# EAGLE design tx_uts_wafer1 (EAGLE 8.3.2)
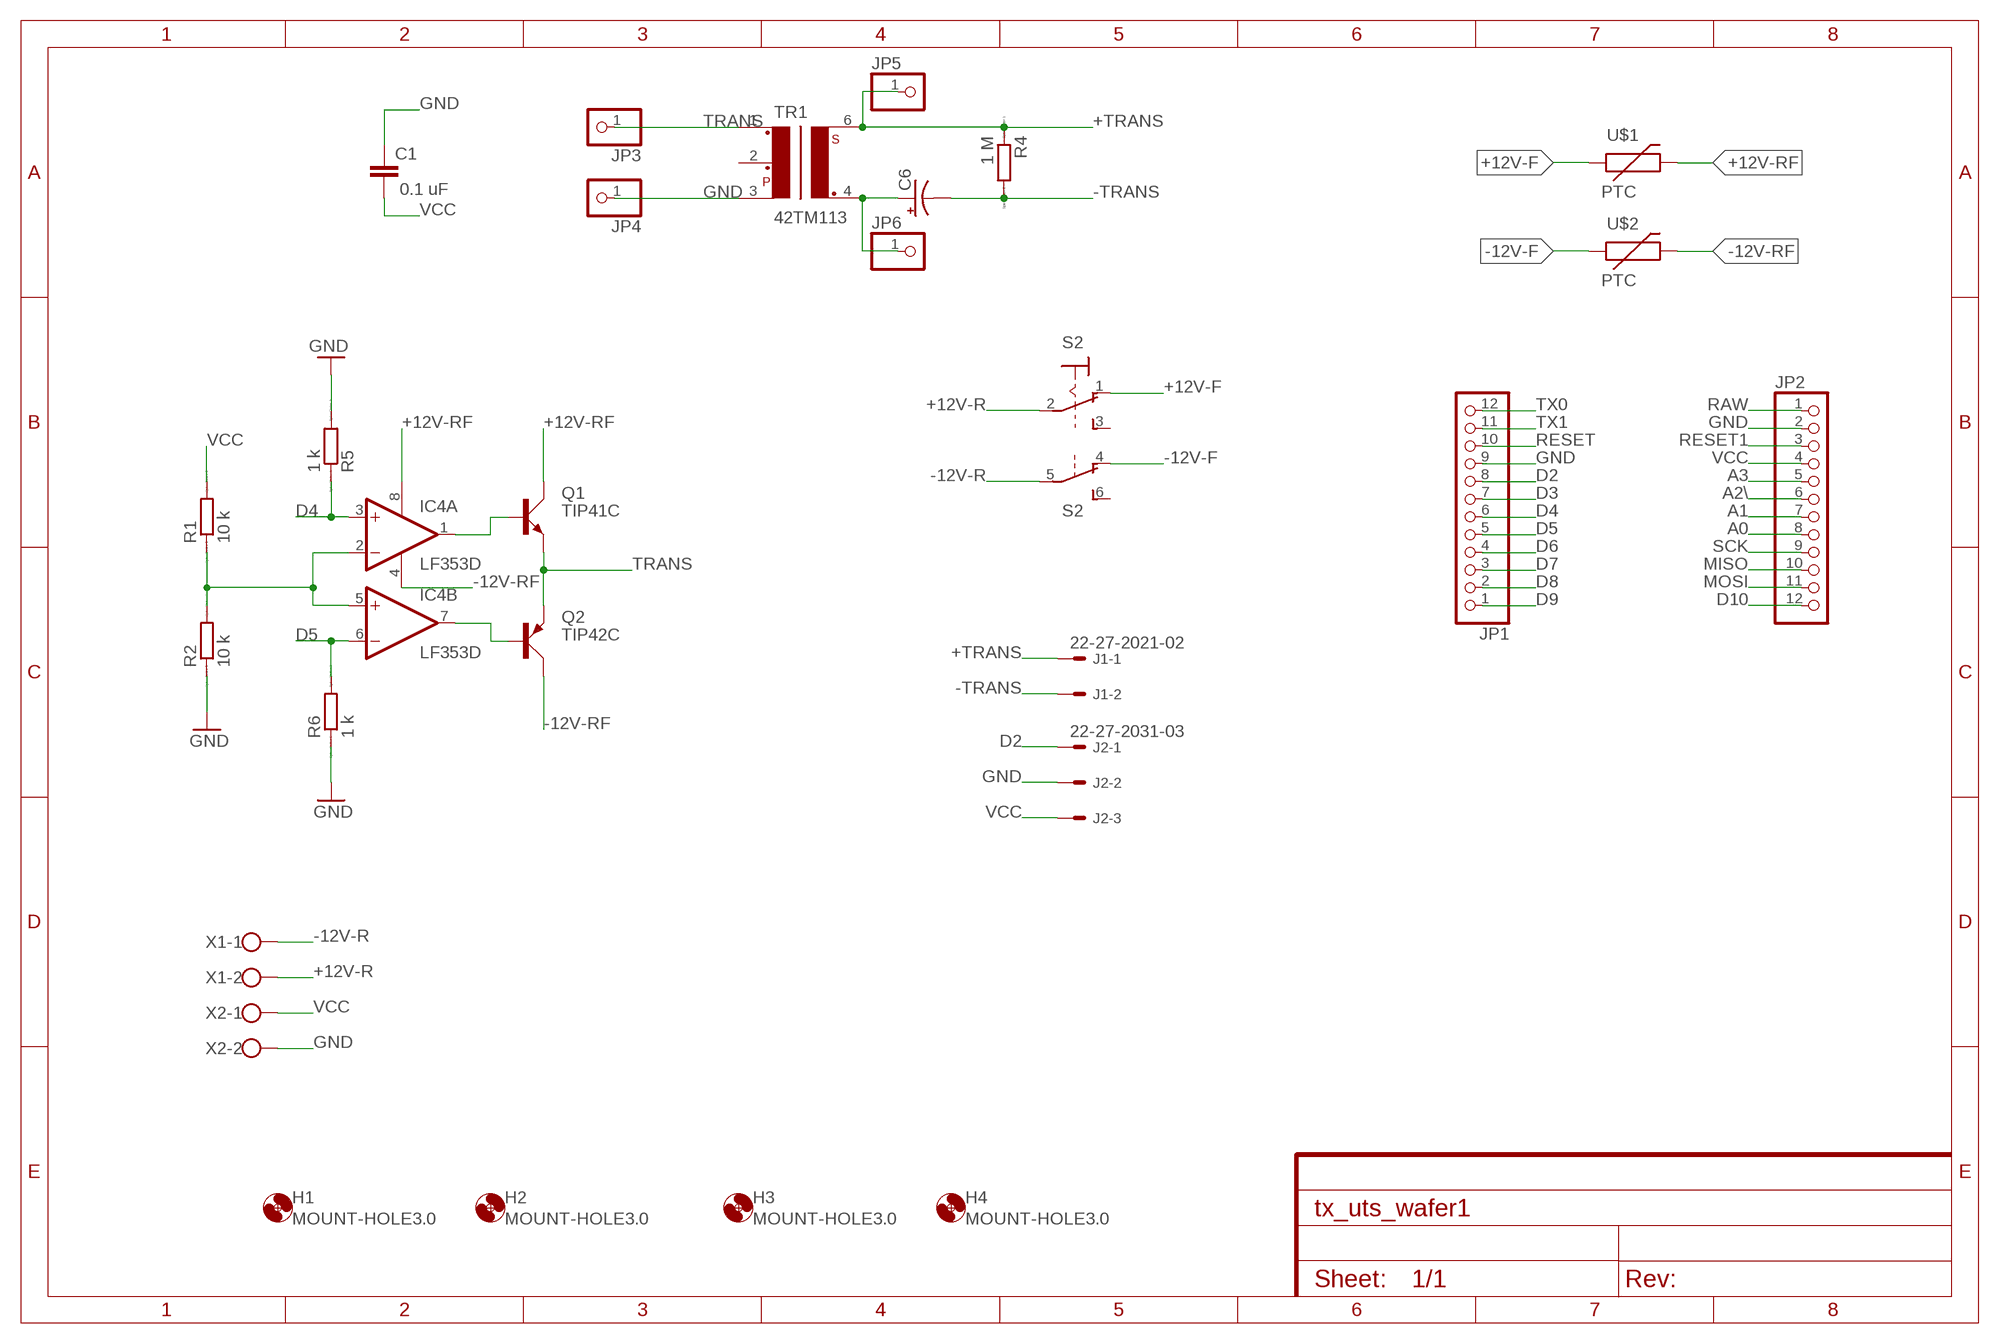
[diagram p0: schematic, sheet 1]

## Parts
C1  0.1 uF  C-EUC0603  [C0603]
C6  CAP_POLC  [PANASONIC_C]
H1  MOUNT-HOLE3.0  [3,0]
H2  MOUNT-HOLE3.0  [3,0]
H3  MOUNT-HOLE3.0  [3,0]
H4  MOUNT-HOLE3.0  [3,0]
IC4  LF353D  [SO08]
J1  22-27-2021-02  [6410-02]
J2  22-27-2031-03  [6410-03]
JP1  PINHD-1X12  [1X12]
JP2  PINHD-1X12  [1X12]
JP3  PINHD-1X1  [1X01]
JP4  PINHD-1X1  [1X01]
JP5  PINHD-1X1  [1X01]
JP6  PINHD-1X1  [1X01]
Q1  TIP41C  [TO220AV]
Q2  TIP42C  [TO220AV]
R1  10 k  RR0603  [R0603]
R2  10 k  RR0603  [R0603]
R4  1 M  RR0603  [R0603]
R5  1 k  RR0603  [R0603]
R6  1 k  RR0603  [R0603]
S2  M9040P2  [M9040P2]
TR1  42TM113  [42TM]
U$1  PTC  [MC331XX]
U$2  PTC  [MC331XX]
X1  W237-102  [W237-102]
X2  W237-102  [W237-102]

## Nets
+12V-F: S2.1(1:O) U$1.P$1
+12V-R: S2.2(1:P) X1.2
+12V-RF: IC4.8(P:V+) Q1.C U$1.P$2
+TRANS: J1.1 JP5.1 R4.1 TR1.6
-12V-F: S2.4(2:O) U$2.P$1
-12V-R: S2.5(2:P) X1.1
-12V-RF: IC4.4(P:V-) Q2.C U$2.P$2
-TRANS: C6.- J1.2 R4.2
A0: JP2.8
A1: JP2.7
A2\: JP2.6
A3: JP2.5
D2: J2.1 JP1.8
D3: JP1.7
D4: IC4.3(A:+IN) JP1.6 R5.1
D5: IC4.6(B:-IN) JP1.5 R6.2
D6: JP1.4
D7: JP1.3
D8: JP1.2
D9: JP1.1
D10: JP2.12
GND [vcc]: C1.1 J2.2 JP1.9 JP2.2 JP4.1 R2.1 R5.2 R6.1 TR1.3 X2.2
MISO: JP2.10
MOSI: JP2.11
N$1: IC4.7(B:OUT) Q2.B
N$3: IC4.1(A:OUT) Q1.B
N$9: C6.+ JP6.1 TR1.4
RAW [vcc]: JP2.1
RESET: JP1.10
RESET1: JP2.3
SCK: JP2.9
TRANS: JP3.1 Q1.E Q2.E TR1.1
TX0: JP1.12
TX1: JP1.11
VCC: C1.2 J2.3 JP2.4 R1.2 X2.1
VREF: IC4.2(A:-IN) IC4.5(B:+IN) R1.1 R2.2
Unconnected: S2.3(1:S) S2.6(2:S) TR1.2

## Library data of the parts
C1 = resistor:C-EU: CAPACITOR, European symbol
C6 = SparkFun-Passives:CAP_POL: Capacitor Polarized These are standard SMD and PTH capacitors. Normally 10uF, 47uF, and 100uF in electrolytic and tantalum varieties. Always verify the external diameter of the through hole cap, it varies with capacity, voltage, and manufacturer. The EIA devices should be standard.
H1-H4 = holes:MOUNT-HOLE: MOUNTING HOLE with drill center marker
IC4 = linear3:LF353: OP AMP
J1 = con-molex:22-?-02: CONNECTOR wire to board 2.54 mm (.1 inch) pitch header; OC_FARNELL: unknown; OC_NEWARK: unknown
J2 = con-molex:22-?-03: CONNECTOR wire to board 2.54 mm (.1 inch) pitch header; OC_FARNELL: unknown; OC_NEWARK: unknown
JP1 JP2 = pinhead:PINHD-1X12: PIN HEADER
JP3-JP6 = pinhead:PINHD-1X1: PIN HEADER
Q1 = transistor-power:TIP41C: NPN TRANSISTOR
Q2 = transistor-power:TIP42C: PNP TRANSISTOR
R1 R2 R4-R6 = eagle-ltspice:R: RESISTOR, European symbol; SPICEMODEL: NONE; SPICEPREFIX: R
S2 = switch:M9040P2: TOGGLE SWITCH Marquardt
TR1 = trafo-xicon:42TM113: Transformer Mouser 42TLM Series Source: http://www.mouser.com/catalog/specsheets/164267.pdf; OC_FARNELL: unknown; OC_NEWARK: unknown
U$1 U$2 = GeekAmmo:PTC: PTC Resettable Fuse
X1 X2 = con-wago-500:W237-102: WAGO SCREW CLAMP; MPN: 237-102; OC_FARNELL: unknown; OC_NEWARK: 70K9898

## Net classes
1 vcc: width 0.254 mm

## Board
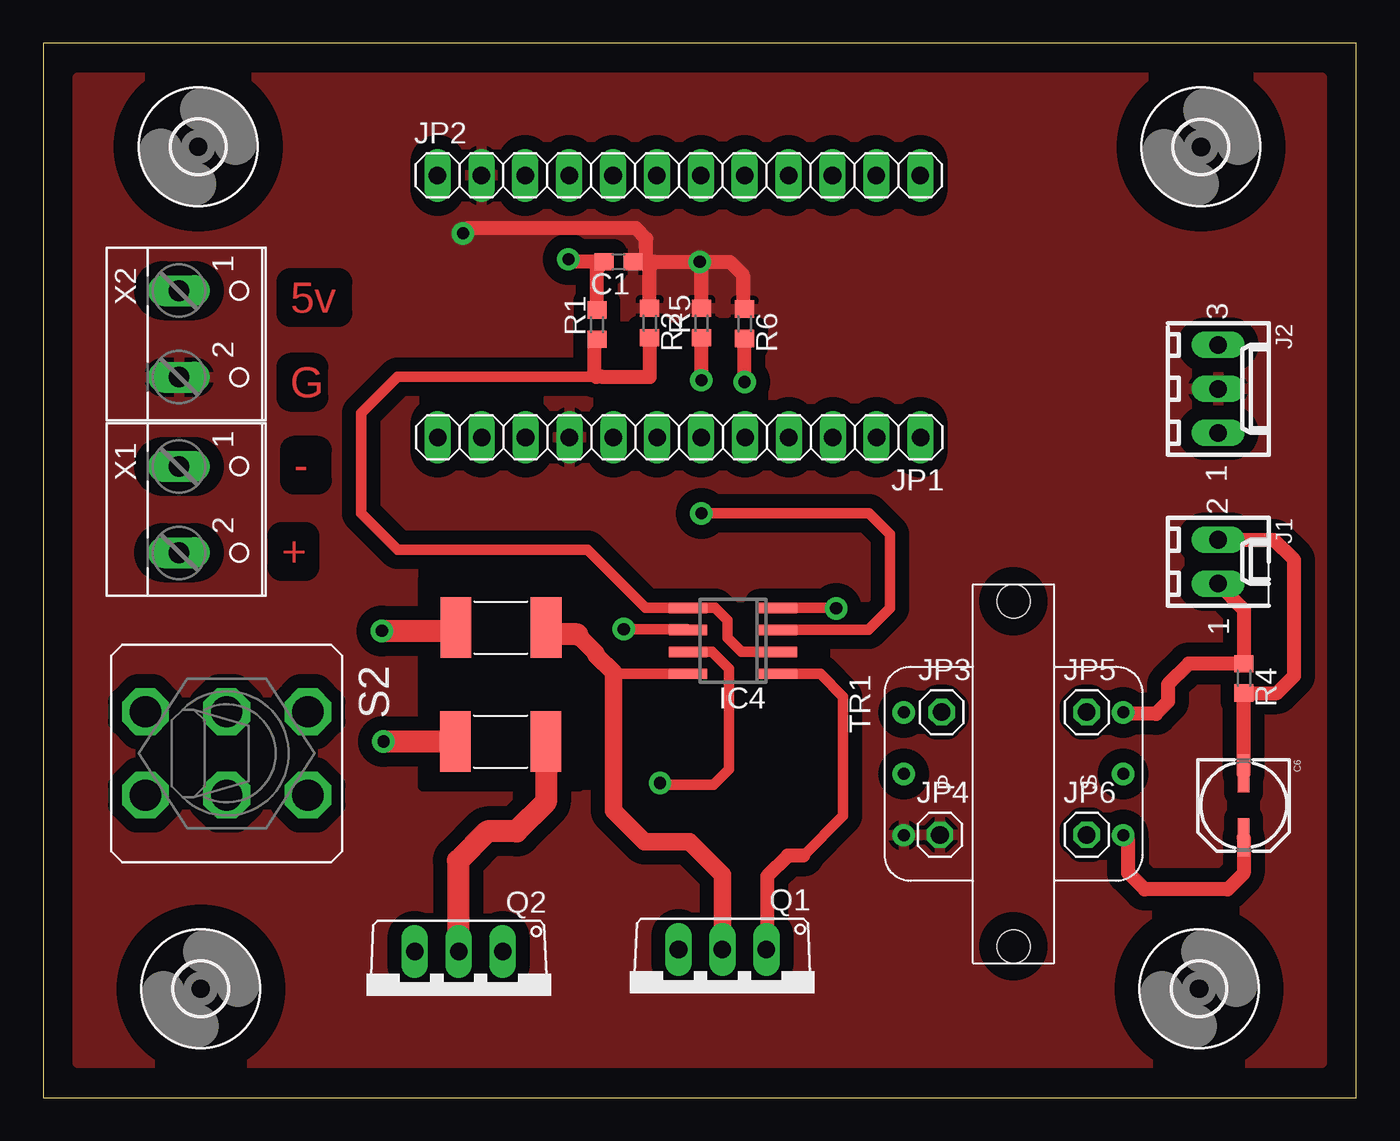
[diagram p1: board, top side]
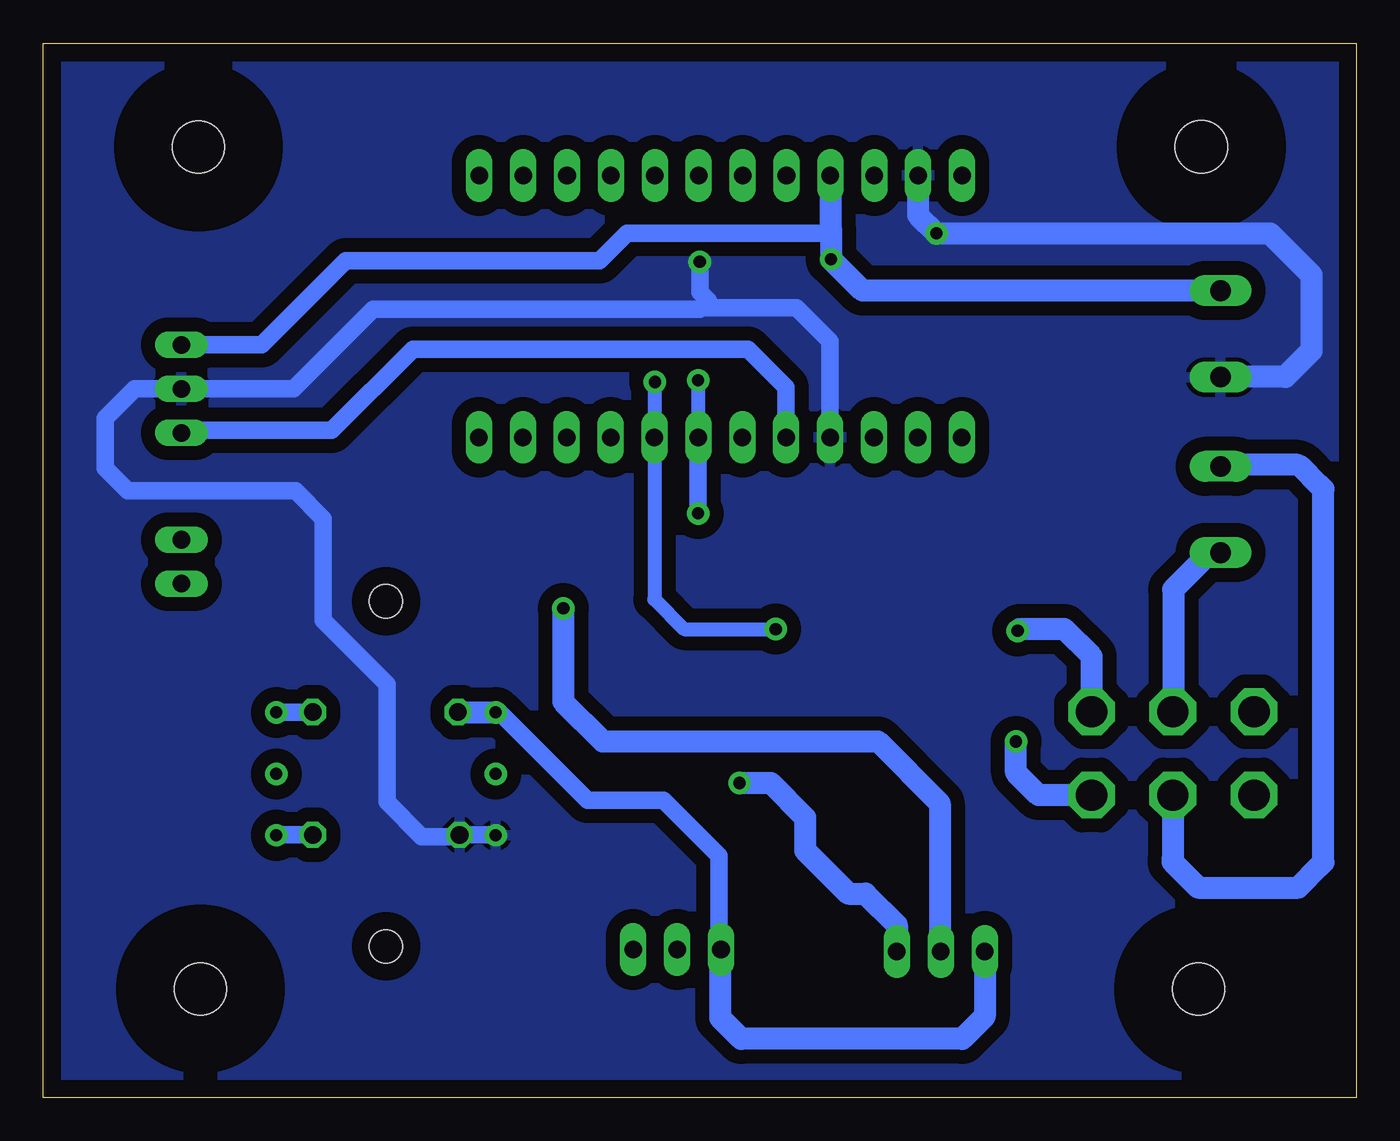
[diagram p2: board, bottom side, seen from below]

Size 76 x 61 mm. Coordinates in mm from the lower left corner, seen from the top.
Outline: 0,0 76,0 76,61 0,61 0,0
Copper layers (1*16): Top 0.035mm / dielectric 1.5mm / Bottom 0.035mm
Design rules "default": minimum track width 6mil, minimum drill 0.35mm, track to track 6mil, track to pad 6mil, pad to pad 6mil, via to via 6mil, smd to smd 6mil, copper to edge 40mil, drill to drill 6mil, minimum pad ring 10mil, minimum via ring 8mil, stop-mask expansion 4mil, vias tented up to drill 0mil, thermal gap 10mil

### Footprints (pad centres in the part's own frame; a part is rotated, then mirrored left to right if it is on the bottom)
C0603 = smd 1.1 x 1: 1 -0.85,0; 2 0.85,0
PANASONIC_C = smd 2.2 x 0.65: + 1.9,-0.2; - -1.8,-0.2
3,0 = hole 3: 0,0
SO08 = smd 0.6 x 2.2: 1 -1.905,-2.6; 2 -0.635,-2.6; 3 0.635,-2.6; 4 1.905,-2.6; 5 1.905,2.6; 6 0.635,2.6; 7 -0.635,2.6; 8 -1.905,2.6
6410-02 = drill 1.016 long: 1 1.27,0; 2 -1.27,0
6410-03 = drill 1.016 long: 1 2.54,0; 2 0,0; 3 -2.54,0
1X12 = drill 1.016 long: 1 -13.97,0; 2 -11.43,0; 3 -8.89,0; 4 -6.35,0; 5 -3.81,0; 6 -1.27,0; 7 1.27,0; 8 3.81,0; 9 6.35,0; 10 8.89,0; 11 11.43,0; 12 13.97,0
1X01 = drill 1.016 octagon: 1 0,0
TO220AV = drill 1.016 long: B -2.54,-2.54; C 0,-2.54; E 2.54,-2.54
R0603 = smd 1 x 1.1: 1 -0.85,0; 2 0.85,0
M9040P2 = drill 1.803 octagon: 1 -2.413,4.699; 2 -2.413,0; 3 -2.413,-4.699; 4 2.413,4.699; 5 2.413,0; 6 2.413,-4.699
42TM = drill 0.7 pad 1.3: 1 -3.556,-6.35; 2 0,-6.35; 3 3.556,-6.35; 4 3.556,6.35; 5 0,6.35; 6 -3.556,6.35 | hole 1.9: -9.982,0; 9.982,0
MC331XX = smd 1.78 x 3.5: P$1 0,0; P$2 5.23,0
W237-102 = drill 1.194 long: 1 -2.5,-1.27; 2 2.5,-1.27

### Placement (x,y rotation side)
C1  33.3,48.35 180 top
C6  69.68,16.95 270 top
H1  8.97,55.01 0 top
H2  66.9,6.29 0 top
H3  67.01,55 0 top
H4  9.12,6.29 0 top
IC4  39.92,26.42 90 top
J1  68,31 270 top
J2  68,41 270 top
JP1  36.81,38.2 180 top
JP2  36.79,53.35 0 top
JP3  52,22.3 0 top
JP4  51.9,15.2 0 top
JP5  60.4,22.3 0 top
JP6  60.4,15.2 0 top
Q1  39.31,6.03 180 top
Q2  24.05,5.9 180 top
R1  32.05,44.72 90 top
R2  35.1,44.81 270 top
R4  69.5,24.25 270 top
R5  38.1,44.81 90 top
R6  40.6,44.77 270 top
S2  10.62,19.91 270 top
TR1  56.16,18.73 270 top
U$1  23.88,27.19 0 top
U$2  23.86,20.59 0 top
X1  9.13,34.02 270 top
X2  9.13,44.18 270 top

### Tracks (layer width: path | path; a pad name or v marks a point on that pad's centre or on a via)
+12V-F  (via drill 0.7 pad 1.3)
  Top 1.27: v19.6,27 23.69,27 U$1.P$1
  Bottom 1.27: S2.1 15.32,25.52 16.9,27.1 19.5,27.1 v19.6,27
+12V-R
  Bottom 1.27: X1.2 8.48,31.52 10.6,29.4 10.6,22.34 S2.2
+12V-RF
  Top 0.61: 32,25.6 33.09,24.52 IC4.8
  Top 1.016: 30.9,26.8 32,25.7 32,25.6 33,24.6 33,16.6 34.8,14.8 37.4,14.8 39.31,12.89 Q1.C
  Top 1.27: 30.9,26.8 29.5,26.8 U$1.P$2
+TRANS
  Top 0.813: J1.1 69.5,28.23 R4.1 66.3,25.1 65.1,23.9 65.1,22.9 64.4,22.2 62.6,22.2 TR1.6
  Bottom 1.016: JP5.1 62.5,22.3 TR1.6
-12V-F  (via drill 0.7 pad 1.3)
  Top 1.27: v19.7,20.6 U$2.P$1
  Bottom 1.27: S2.4 18.4,17.5 19.7,18.8 v19.7,20.6
-12V-R
  Bottom 0.152: 10.62,14.8 S2.5 | 10.62,14.8 10.62,14.72 | 2.1,13.4 1.9,13.6 | 2,35.3 2.1,35.4 | 3.25,36.55 3.3,36.6 3.4,36.6 | 10.62,14.8 10.62,13.8
  Bottom 1.27: S2.5 10.62,13.8 10.62,13.62 9.15,12.15 3.35,12.15 2.1,13.4 | 1.9,13.6 1.9,35.2 2,35.3 | 2.1,35.4 3.25,36.55 | 3.4,36.6 7.78,36.6 X1.1
-12V-RF  (via drill 0.7 pad 1.3)
  Top 0.61: IC4.4 45.88,28.32 v45.9,28.3
  Top 1.27: U$2.P$2 29.09,17.09 27.4,15.4 25.7,15.4 24,13.7 24,8.49 Q2.C
  Bottom 1.27: v45.9,28.3 45.9,22.9 43.6,20.6 27.7,20.6 24.1,17 24.1,8.49 Q2.C
-TRANS
  Top 0.813: C6.- 69.48,23.38 R4.2 71.4,23.4 72.4,24.4 72.4,31.1 71.23,32.27 J1.2
D2
  Bottom 1.016: JP1.8 33,41.1 35.2,43.3 54.6,43.3 59.3,38.6 67.86,38.6 J2.1
D4  (via drill 0.7 pad 1.3)
  Top 0.61: IC4.3 47.76,27.05 49,28.3 49,32.6 47.8,33.8 v38.1,33.8
  Top 0.813: v38.1,41.5 R5.1
  Bottom 0.813: JP1.6 38.08,41.48 v38.1,41.5
  Bottom 1.016: v38.1,33.8 38.1,38.18 JP1.6
D5  (via drill 0.7 pad 1.3)
  Top 0.61: v33.6,27.1 37.27,27.1 IC4.6
  Top 0.813: v40.6,41.4 R6.2
  Bottom 0.813: v40.6,41.4 40.62,41.38 JP1.5 40.62,28.82 38.9,27.1 v33.6,27.1
GND  (via drill 0.7 pad 1.3)
  Top 0.813: 35.4,48.35 v38,48.35 | 35.4,48.35 34.9,48.35 | 34.9,48.35 C1.1 | v38,48.35 39.75,48.35 40.5,47.6 40.5,45.72 R6.1 | R5.2 38.1,48.25 v38,48.35 | R2.1 35.1,48.05 35.4,48.35 | 34.9,48.35 34.9,49.7 34.3,50.3 24.6,50.3 v24.3,50
  Bottom 1.016: v38,48.35 38,46.6 37.5,46.1 38,45.6 | 38,45.6 56.9,45.6 61.5,41 J2.2 70.7,41 72.4,39.3 72.4,36.4 71.1,35.1 61.4,35.1 59.8,33.5 59.8,27.6 56.1,23.9 56.1,17.1 54.1,15.1 51.7,15.1 51.6,15.2 | JP1.9 30.46,43.76 32.4,45.7 37.9,45.7 38,45.6 | 51.6,15.2 JP4.1 | 51.6,15.2 49.84,15.2 TR1.3
  Bottom 1.27: JP2.2 25.36,51.06 v24.3,50 5,50 2.6,47.6 2.6,43.2 4.1,41.7 7.84,41.7 X2.2
  pour Bottom (isolate 0.813): 1,60 75,60 75,1 1,1
  pour Top (isolate 0.813): 2,59 74,59 74,2 2,2
N$1  (via drill 0.7 pad 1.3)
  Top 0.61: IC4.7 38.72,25.79 39.7,24.8 39.7,22.2 39.7,19 38.8,18.1 35.8,18.1 v35.7,18.2
  Bottom 1.27: v35.7,18.2 33.9,18.2 31.9,16.2 31.9,14.3 29.4,11.8 28.4,11.8 26.6,10 Q2.B
N$2
  cutout Top (isolate 1.93): 22,30 22,18 31,18 31,30
N$3
  Top 0.61: IC4.1 44.98,24.52 46.3,23.2 46.3,16.3 44,14
  Top 0.813: 44,14 43.1,14 41.9,12.8 41.9,8.62 Q1.B
N$9
  Top 0.813: TR1.4 62.8,14.88 62.8,13 63.75,12.05 68.55,12.05 69.48,12.98 C6.+
  Bottom 1.016: JP6.1 62.48,15.2 TR1.4
TRANS
  Bottom 1.016: TR1.1 49.59,22.29 44.5,17.2 40.1,17.2 36.9,14 36.9,8.7 Q1.E
  Bottom 1.27: Q2.E 21.51,4.69 22.8,3.4 35.6,3.4 36.8,4.6 36.8,8.54 Q1.E | TR1.1 51.99,22.29 JP3.1
VCC  (via drill 0.7 pad 1.3)
  Top 0.813: R1.2 32.05,47.95 C1.2 30.55,48.35 v30.4,48.5
  Bottom 1.016: J2.3 63.36,43.54 58.5,48.4 43.8,48.4 42.2,50 30.6,50 30.4,50.2
  Bottom 1.27: X2.1 28.58,46.68 v30.4,48.5 30.4,50.2 30.4,53.31 JP2.4
VREF
  Top 0.61: IC4.2 40.41,25.79 39.6,26.6 39.6,27.6 38.88,28.32 IC4.5 34.88,28.32 31.5,31.7 20.5,31.7 18.4,33.8 18.4,39.6 20.5,41.7 32.4,41.7
  Top 0.813: R2.2 35.1,41.7 32.4,41.7 32,41.7 31.9,41.8 31.9,43.72 R1.1

### Text on the board
Top: 5v | G | - | +